# Altium schematic sheet ST-LINK.SchDoc
size A4; SheetNumber: 5; SheetTotal: 5
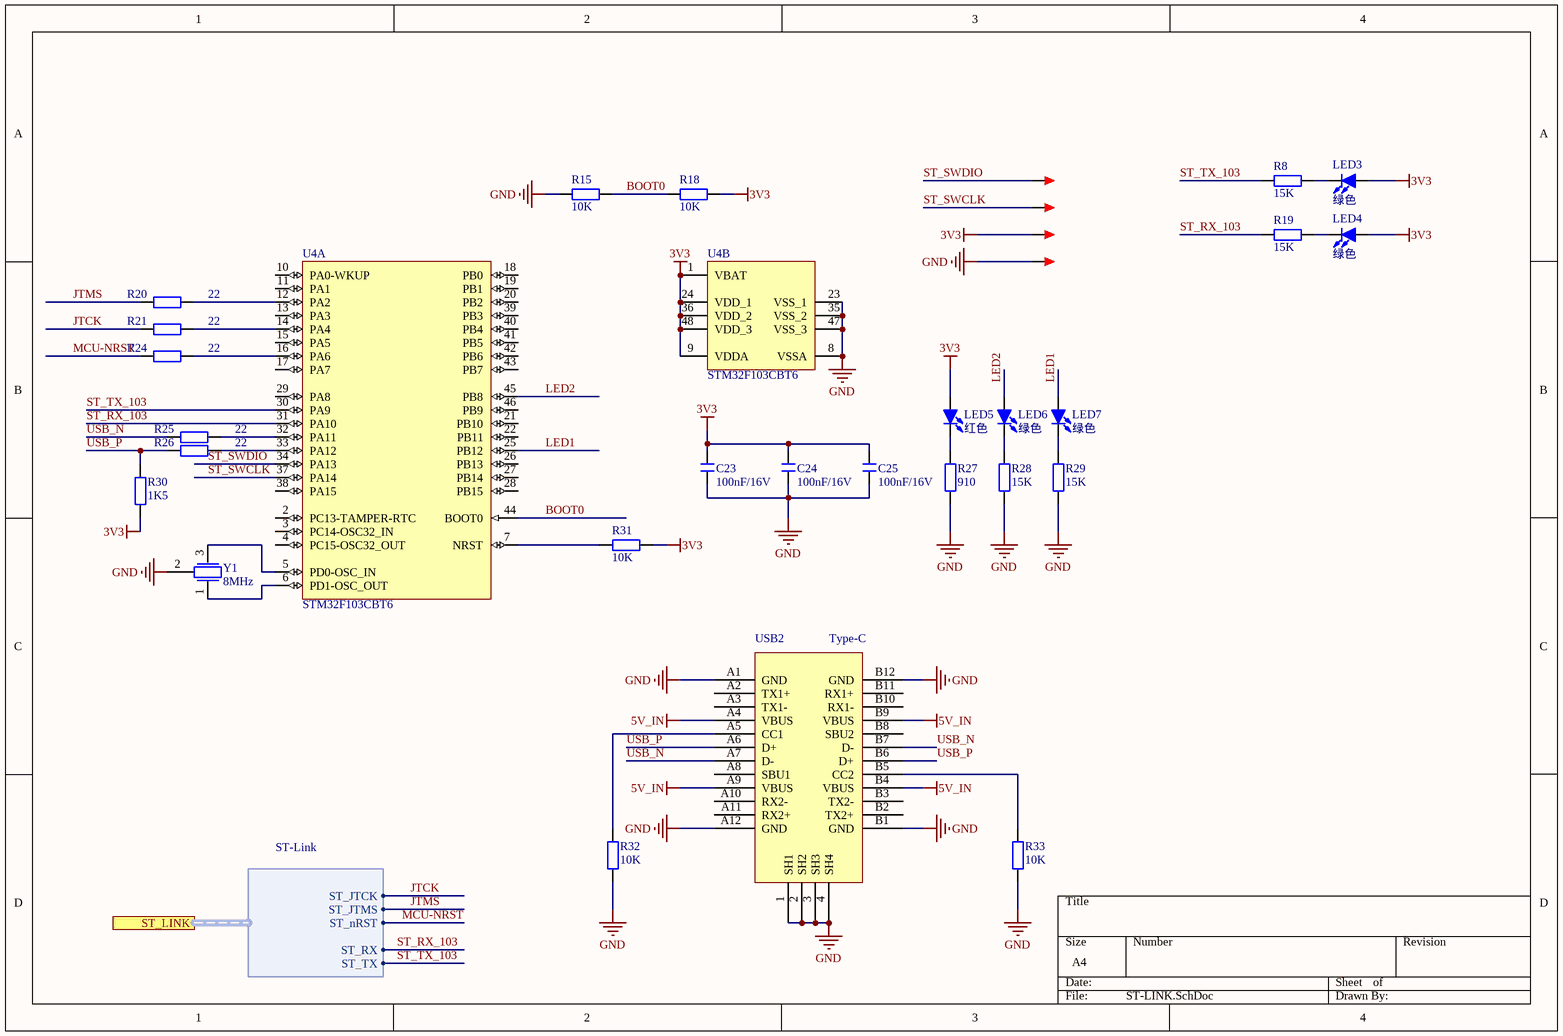
[diagram p0: ST-LINK.SchDoc]

## Parts
C23  100nF/16V  [C 0402_L]
C24  100nF/16V  [C 0402_L]
C25  100nF/16V  [C 0402_L]
LED3  绿色  [LED]
LED4  绿色  [LED]
LED5  红色  [LED]
LED6  绿色  [LED]
LED7  绿色  [LED]
R8  15K  [R 0402_L]
R15  10K  [R 0402_L]
R18  10K  [R 0402_L]
R19  15K  [R 0402_L]
R20  22  [R 0402_L]
R21  22  [R 0402_L]
R24  22  [R 0402_L]
R25  22  [R 0402_L]
R26  22  [R 0402_L]
R27  910  [R 0402_L]
R28  15K  [R 0402_L]
R29  15K  [R 0402_L]
R30  1K5  [R 0402_L]
R31  10K  [R 0402_L]
R32  10K  [R 0402_L]
R33  10K  [R 0402_L]
TP3  TEST  [TEST 1.2]  (value not drawn)
TP4  TEST  [TEST 1.2]  (value not drawn)
TP5  TEST  [TEST 1.2]  (value not drawn)
TP6  TEST  [TEST 1.2]  (value not drawn)
U4  STM32F103CBT6  [LQFP48 7X7_N]  (parts A,B of 2)
USB2  Type-C  [Type-c接口]
Y1  8MHz  [三脚晶振]

## Ports
ST_LINK (harness ST-Link)

## Harnesses
ST-Link: ST_JTCK, ST_JTMS, ST_nRST, ST_RX, ST_TX

## Nets
3V3: C23.2 C24.2 C25.2 LED3.1(A) LED4.1(A) LED5.1(A) R18.1 R30.2 R31.1 TP5.1 U4.1(VBAT) U4.9(VDDA) U4.24(VDD_1) U4.36(VDD_2) U4.48(VDD_3)
5V_IN: USB2.A4(VBUS) USB2.A9(VBUS) USB2.B4(VBUS) USB2.B9(VBUS)
GND: C23.1 C24.1 C25.1 R15.1 R27.1 R28.1 R29.1 R32.1 R33.1 TP6.1 U4.8(VSSA) U4.23(VSS_1) U4.35(VSS_2) U4.47(VSS_3) USB2.1(SH1) USB2.2(SH2) USB2.3(SH3) USB2.4(SH4) USB2.A1(GND) USB2.A12(GND) USB2.B1(GND) USB2.B12(GND) Y1.2
BOOT0: R15.2 R18.2 U4.44(BOOT0)
JTCK: R21.2 ; port ST_LINK.ST_JTCK
JTMS: R20.2 ; port ST_LINK.ST_JTMS
LED1: LED7.1(A) U4.25(PB12)
LED2: LED6.1(A) U4.45(PB8)
MCU-NRST: R24.2 ; port ST_LINK.ST_nRST
ST_RX_103: R19.1 U4.31(PA10) ; port ST_LINK.ST_RX
ST_SWCLK: TP4.1 U4.37(PA14)
ST_SWDIO: TP3.1 U4.34(PA13)
ST_TX_103: R8.1 U4.30(PA9) ; port ST_LINK.ST_TX
USB_N: R25.2 USB2.A7(D-) USB2.B7(D-)
USB_P: R26.2 R30.1 USB2.A6(D+) USB2.B6(D+)
NetLED3_2: LED3.2(K) R8.2
NetLED4_2: LED4.2(K) R19.2
NetLED5_2: LED5.2(K) R27.2
NetLED6_2: LED6.2(K) R28.2
NetLED7_2: LED7.2(K) R29.2
NetR20_1: R20.1 U4.12(PA2)
NetR21_1: R21.1 U4.14(PA4)
NetR24_1: R24.1 U4.16(PA6)
NetR25_1: R25.1 U4.32(PA11)
NetR26_1: R26.1 U4.33(PA12)
NetR31_2: R31.2 U4.7(NRST)
NetR32_2: R32.2 USB2.A5(CC1)
NetR33_2: R33.2 USB2.B5(CC2)
NetU4_5: U4.5(PD0-OSC_IN) Y1.3
NetU4_6: U4.6(PD1-OSC_OUT) Y1.1

Not connected (* = marked no-connect by the designer): U4 2(PC13-TAMPER-RTC) 3(PC14-OSC32_IN) 4(PC15-OSC32_OUT) 10(PA0-WKUP) 11(PA1) 13(PA3) 15(PA5) 17(PA7) 18(PB0) 19(PB1) 20(PB2) 21(PB10) 22(PB11) 26(PB13) 27(PB14) 28(PB15) 29(PA8) 38(PA15) 39(PB3) 40(PB4) 41(PB5) 42(PB6) 43(PB7) 46(PB9); USB2 A2(TX1+) A3(TX1-) A8(SBU1) A10(RX2-) A11(RX2+) B2(TX2+) B3(TX2-) B8(SBU2) B10(RX1-) B11(RX1+)

## Library data of the parts
C23-C25 = C: 贴片电容; 主类型: 电容; 值精度: ±10%; 元件封装: 0402; 具体类型: 陶瓷电容; 封装类型: 贴片; 温度漂移: X7R（15%）; 温度范围: -55°C ~ 125°C; 生产商: YAGEO(国巨); 生产商零件编码: CC0402KRX7R7BB104; 值/型号: 100nF/16V; 立创编号: C60474
LED3-LED7 = LED-SMD: C84267
R8 R19 R28 R29 = R: 贴片电阻 0402 5%; 主类型: 电阻; 值精度: ±1%; 元件封装: 0402; 封装类型: 贴片; 温度漂移: 50ppm; 生产商: 国巨; 生产商零件编码: RT0402FRE0715KL; 值/型号: 15K; 具体类型: 贴片电阻; 立创编号: C136975
R15 R18 R31-R33 = R: 贴片电阻; 主类型: 电阻; 值精度: ±1%; 元件封装: 0402; 封装类型: 贴片; 温度漂移: ±100ppm/℃; 生产商: YAGEO（国巨）; 生产商零件编码: RC0402FR-0710KL; 值/型号: 10K; 具体类型: 贴片电阻; 立创编号: C60490
R20 R21 R24-R26 = R: 贴片电阻; 主类型: 电阻; 值/型号: 10K; 值精度: ±1%; 元件封装: 0402; 封装类型: 贴片; 温度漂移: ±100ppm/℃; 生产商: YAGEO（国巨）; 生产商零件编码: RC0402FR-0710KL; 具体类型: 贴片电阻; 立创编号: C60490
R27 = R: 贴片电阻 0402 5%; 主类型: 电阻; 值精度: ±1%; 元件封装: 0402; 封装类型: 贴片; 温度漂移: 50ppm; 生产商: UNI-ROYAL(厚声); 生产商零件编码: 0402WGF9100TCE; 值/型号: 910; 具体类型: 贴片电阻; 立创编号: C44933
R30 = R: 贴片电阻; 主类型: 电阻; 值/型号: 1.5K; 值精度: ±1%; 元件封装: 0402; 封装类型: 贴片; 生产商: YAGEO(国巨); 生产商零件编码: RC0402FR-071K5L; 具体类型: 贴片电阻; 立创编号: C114759
TP3-TP6 = TEST: 测试点
U4 = STM32F103CBT6: ARM Cortex-M3 32-bit MCU, 128 KB Flash, 20 KB Internal RAM, 37 I/Os, 48-pin LQFP, -40 to 85 degC, Tray
USB2 = USB-Type-C-TOP
Y1 = 晶振-3Pin: 村田贴片